# Altium schematic sheet p1_power_supply_10v.SchDoc
size A2; Organization: Protel International P/L; Address1: L3, 12a Rodborough Rd; Address2: Frenchs Forest; Address3: NSW; Address4: Australia 2086
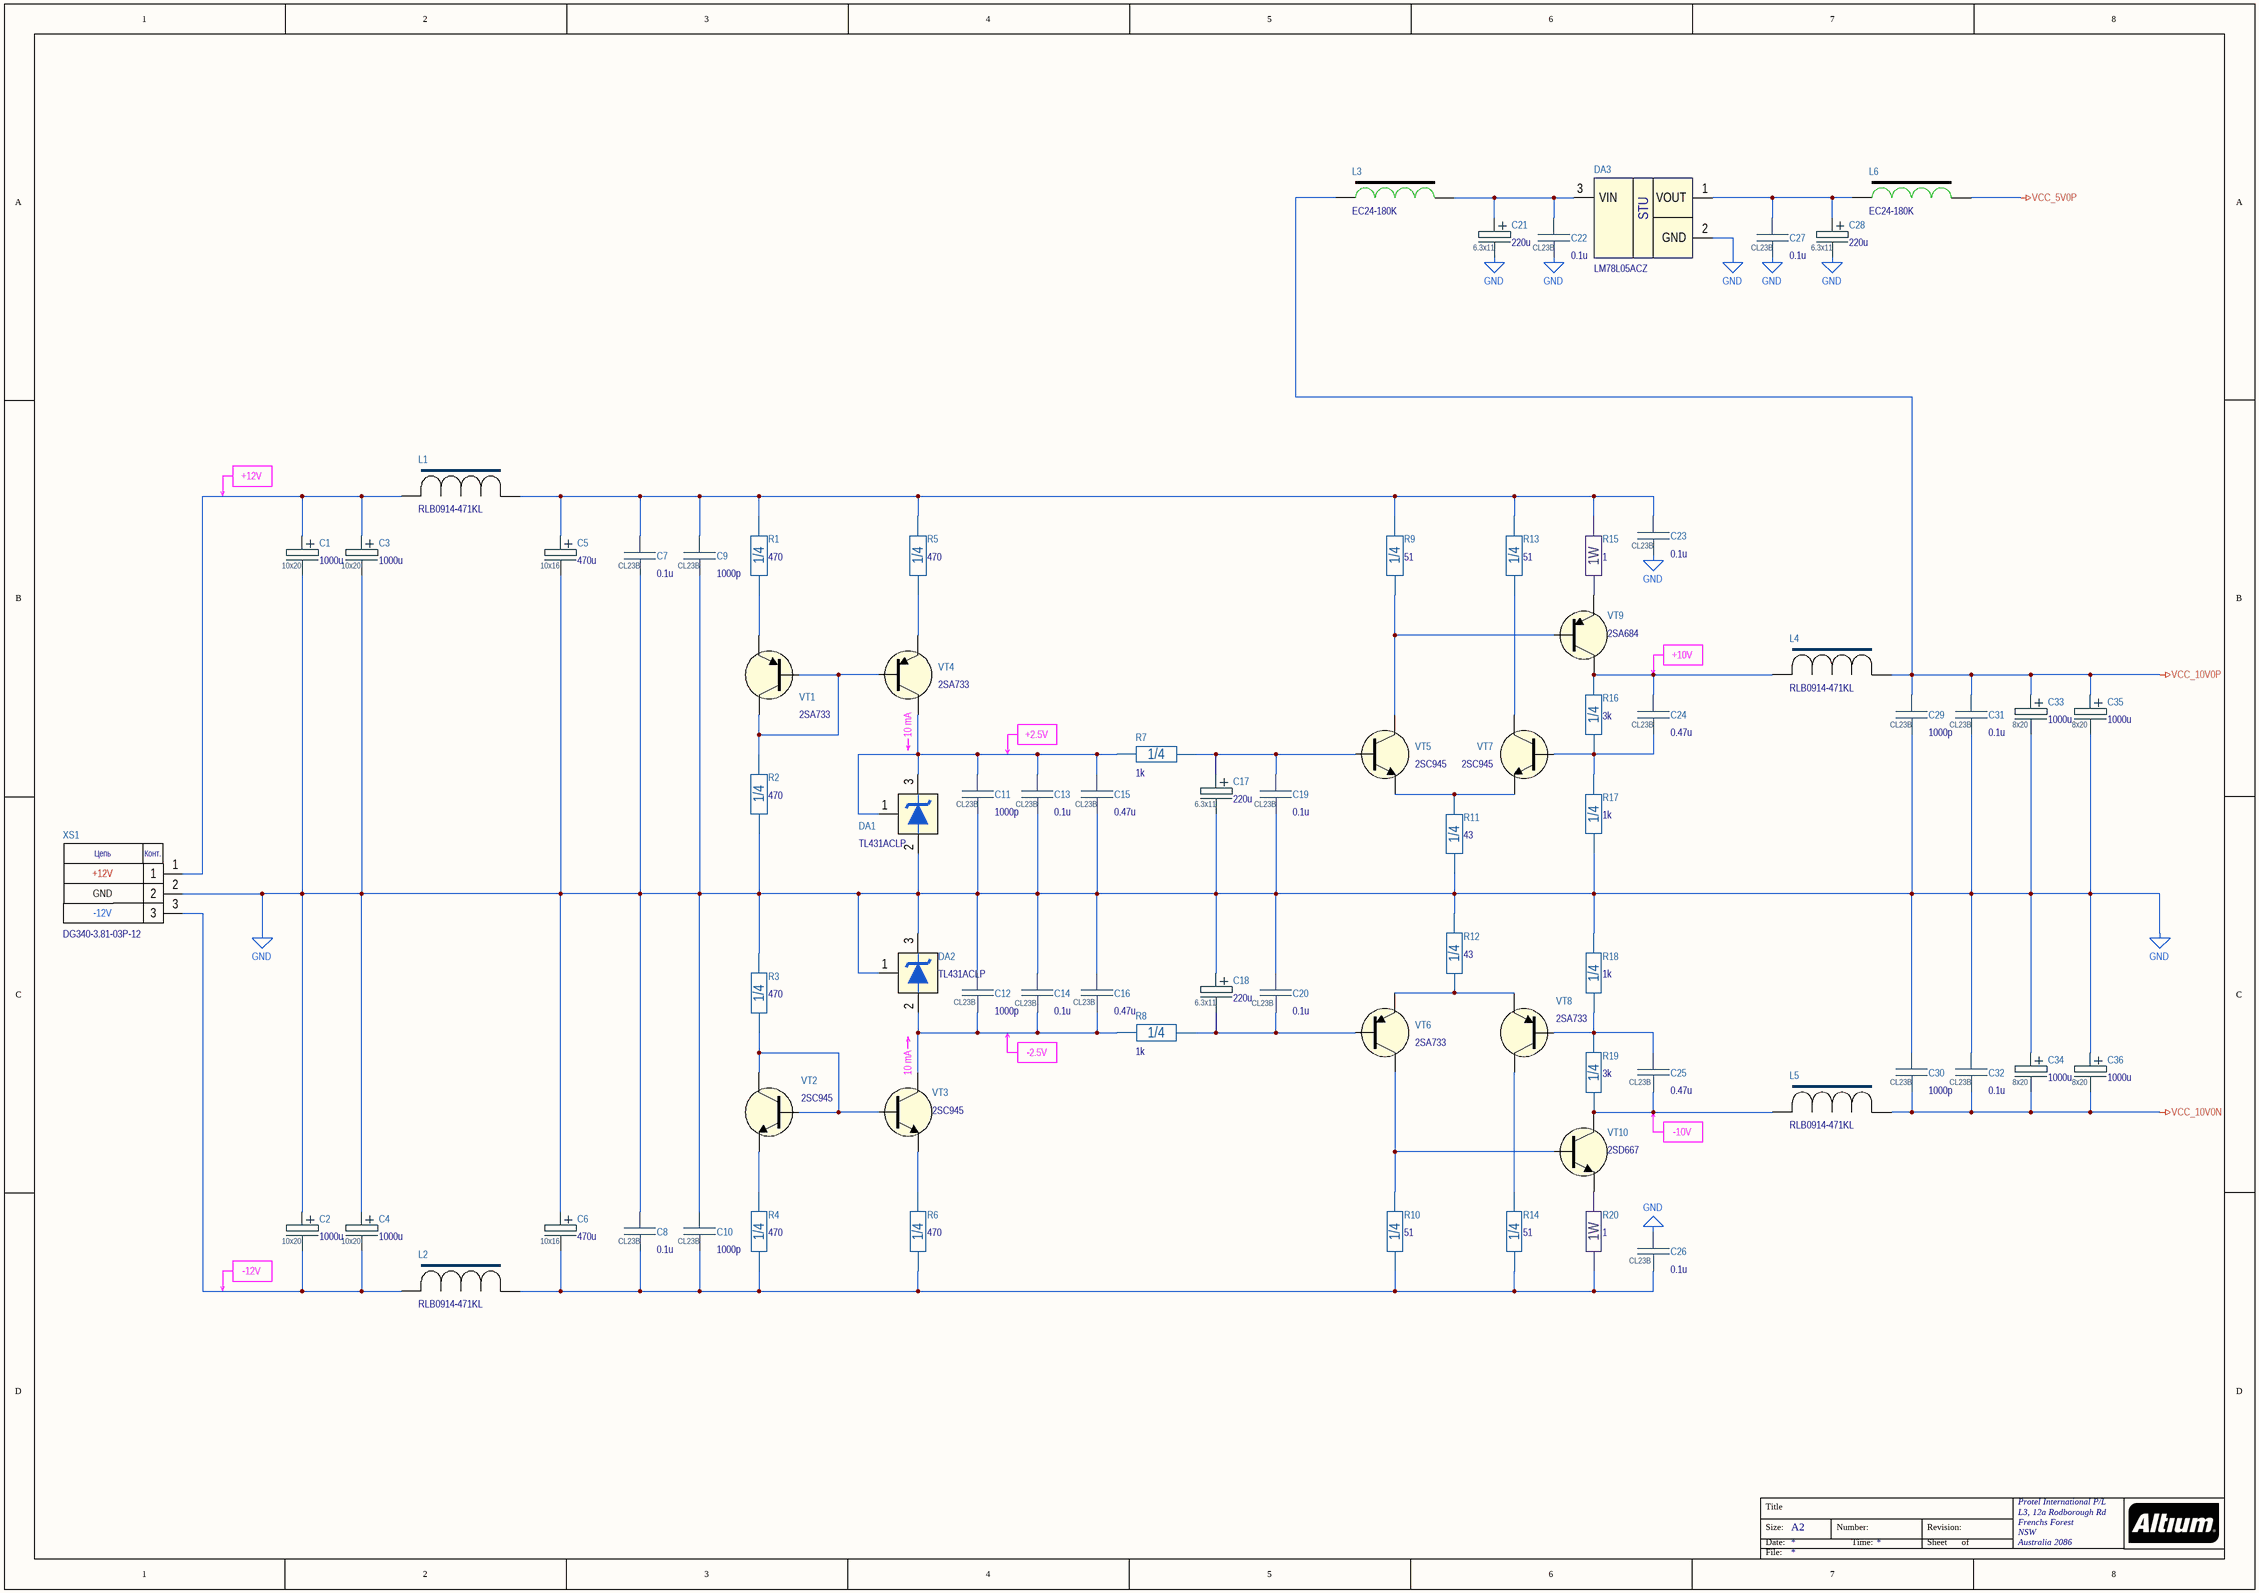
[diagram p0: p1_power_supply_10v.SchDoc]

## Parts
C1  1000u  Package: 10x20  [ECAP10X21X5_BRW]
C2  1000u  Package: 10x20  [ECAP10X21X5_BRW]
C3  1000u  Package: 10x20  [ECAP10X21X5_BRW]
C4  1000u  Package: 10x20  [ECAP10X21X5_BRW]
C5  470u  Package: 10x16  [ECAP10X17X5_BRW]
C6  470u  Package: 10x16  [ECAP10X17X5_BRW]
C7  0.1u  [CL23B_7.2x2.5]
C8  0.1u  [CL23B_7.2x2.5]
C9  1000p  [CL23B_7.2x2.5]
C10  1000p  [CL23B_7.2x2.5]
C11  1000p  [CL23B_7.2x2.5]
C12  1000p  [CL23B_7.2x2.5]
C13  0.1u  [CL23B_7.2x2.5]
C14  0.1u  [CL23B_7.2x2.5]
C15  0.47u  [CL23B_7.2x3.5]
C16  0.47u  [CL23B_7.2x3.5]
C17  220u  Package: 6.3x11  [ECAP6.3X11X2.5_BRW]
C18  220u  Package: 6.3x11  [ECAP6.3X11X2.5_BRW]
C19  0.1u  [CL23B_7.2x2.5]
C20  0.1u  [CL23B_7.2x2.5]
C21  220u  Package: 6.3x11  [ECAP6.3X11X2.5_BRW]
C22  0.1u  [CL23B_7.2x2.5]
C23  0.1u  [CL23B_7.2x2.5]
C24  0.47u  [CL23B_7.2x3.5]
C25  0.47u  [CL23B_7.2x3.5]
C26  0.1u  [CL23B_7.2x2.5]
C27  0.1u  [CL23B_7.2x2.5]
C28  220u  Package: 6.3x11  [ECAP6.3X11X2.5_BRW]
C29  1000p  [CL23B_7.2x2.5]
C30  1000p  [CL23B_7.2x2.5]
C31  0.1u  [CL23B_7.2x2.5]
C32  0.1u  [CL23B_7.2x2.5]
C33  1000u  Package: 8x20  [ECAP8X20X3.5_BRW]
C34  1000u  Package: 8x20  [ECAP8X20X3.5_BRW]
C35  1000u  Package: 8x20  [ECAP8X20X3.5_BRW]
C36  1000u  Package: 8x20  [ECAP8X20X3.5_BRW]
DA1  TL431ACLP  [TO-92 (VERTICAL,LINE)]
DA2  TL431ACLP  [TO-92 (VERTICAL,LINE)]
DA3  LM78L05ACZ  [TO-92 (VERTICAL,LINE)]
L1  RLB0914-471KL  [RLB0914]
L2  RLB0914-471KL  [RLB0914]
L3  EC24-180K  [EC24_GREEN]
L4  RLB0914-471KL  [RLB0914]
L5  RLB0914-471KL  [RLB0914]
L6  EC24-180K  [EC24_GREEN]
R1  470  Package: 1/4  [CFR-25]
R2  470  Package: 1/4  [CFR-25]
R3  470  Package: 1/4  [CFR-25]
R4  470  Package: 1/4  [CFR-25]
R5  470  Package: 1/4  [CFR-25]
R6  470  Package: 1/4  [CFR-25]
R7  1k  Package: 1/4  [CFR-25]
R8  1k  Package: 1/4  [CFR-25]
R9  51  Package: 1/4  [CFR-25]
R10  51  Package: 1/4  [CFR-25]
R11  43  Package: 1/4  [CFR-25]
R12  43  Package: 1/4  [CFR-25]
R13  51  Package: 1/4  [CFR-25]
R14  51  Package: 1/4  [CFR-25]
R15  1  Package: 1W  [CFR-100]
R16  3k  Package: 1/4  [CFR-25]
R17  1k  Package: 1/4  [CFR-25]
R18  1k  Package: 1/4  [CFR-25]
R19  3k  Package: 1/4  [CFR-25]
R20  1  Package: 1W  [CFR-100]
VT1  2SA733  [TO-92 (VERTICAL,LINE)]
VT2  2SC945  [TO-92 (VERTICAL,LINE)]
VT3  2SC945  [TO-92 (VERTICAL,LINE)]
VT4  2SA733  [TO-92 (VERTICAL,LINE)]
VT5  2SC945  [TO-92 (VERTICAL,LINE)]
VT6  2SA733  [TO-92 (VERTICAL,LINE)]
VT7  2SC945  [TO-92 (VERTICAL,LINE)]
VT8  2SA733  [TO-92 (VERTICAL,LINE)]
VT9  2SA684  [TO-92L (VERTICAL,LINE)]
VT10  2SD667  [TO-92L (VERTICAL,LINE)]
XS1  DG340-3.81-03P-12  [DG340-3.81-03P]

## Nets
GND: C1.2 C2.1 C3.2 C4.1 C5.2 C6.1 C7.2 C8.1 C9.2 C10.1 C11.2 C12.2 C13.2 C14.2 C15.2 C16.2 C17.2 C18.1 C19.2 C20.2 C21.2 C22.2 C23.2 C26.2 C27.2 C28.2 C29.2 C30.1 C31.2 C32.1 C33.2 C34.1 C35.2 C36.1 DA1.2(ANODE) DA2.1(REF) DA2.3(CATHODE) DA3.2(GND) R2.1 R3.1 R11.2 R12.2 R17.2 R18.2 XS1.2
VCC_5V0P: L6.2
VCC_10V0N: C30.2 C32.2 C34.2 C36.2 L5.2
VCC_10V0P: C29.1 C31.1 C33.1 C35.1 L3.1 L4.2
NetC1_1: C1.1 C3.1 L1.1 XS1.1
NetC2_2: C2.2 C4.2 L2.1 XS1.3
NetC5_1: C5.1 C7.1 C9.1 C23.1 L1.2 R1.2 R5.2 R9.2 R13.2 R15.2
NetC6_2: C6.2 C8.2 C10.2 C26.1 L2.2 R4.2 R6.2 R10.2 R14.2 R20.2
NetC11_1: C11.1 C13.1 C15.1 DA1.1(REF) DA1.3(CATHODE) R7.2 VT4.2(C)
NetC12_1: C12.1 C14.1 C16.1 DA2.2(ANODE) R8.2 VT3.2(C)
NetC17_1: C17.1 C19.1 R7.1 VT5.1(B)
NetC18_2: C18.2 C20.1 R8.1 VT6.1(B)
NetC21_1: C21.1 C22.1 DA3.3(VIN) L3.2
NetC24_1: C24.1 L4.1 R16.1 VT9.2(C)
NetC24_2: C24.2 R16.2 R17.1 VT7.1(B)
NetC25_1: C25.1 L5.1 R19.1 VT10.2(C)
NetC25_2: C25.2 R18.1 R19.2 VT8.1(B)
NetC27_1: C27.1 C28.1 DA3.1(VOUT) L6.1
NetR1_1: R1.1 VT1.3(E)
NetR2_2: R2.2 VT1.1(B) VT1.2(C) VT4.1(B)
NetR3_2: R3.2 VT2.1(B) VT2.2(C) VT3.1(B)
NetR4_1: R4.1 VT2.3(E)
NetR5_1: R5.1 VT4.3(E)
NetR6_1: R6.1 VT3.3(E)
NetR9_1: R9.1 VT5.2(C) VT9.3(B)
NetR10_1: R10.1 VT6.2(C) VT10.3(B)
NetR11_1: R11.1 VT5.3(E) VT7.3(E)
NetR12_1: R12.1 VT6.3(E) VT8.3(E)
NetR13_1: R13.1 VT7.2(C)
NetR14_1: R14.1 VT8.2(C)
NetR15_1: R15.1 VT9.1(E)
NetR20_1: R20.1 VT10.1(E)

## Notes on the sheet
- +12V
- +10V
- (near VT4) 10 mA
- +2.5V
- GND
- -12V
- -2.5V
- (near VT3) 10 mA
- -10V
- Title
- Size:
- Date:
- File:
- A2
- Number:
- Time:
- Revision:
- Sheet
- of
- (in symbol DG340-3.81-03P-12) Цепь; Конт.
- (in symbol LM78L05ACZ) STU

## Library data of the parts
C1-C4 = C_ECAP: Aluminium capacitor; Part Number: UVZ1E102MPD; Manufacturer: Nichicon; Tolerance: ± 20 %; Voltage: 25V; Value: 1000u; Value on schem: 1000u
C5 C6 = C_ECAP: Aluminium capacitor; Part Number: UPW1E471MPD; Manufacturer: Nichicon; Tolerance: ± 20 %; Voltage: 25V; Value: 470u; Value on schem: 470u
C7-C16 C19 C20 C22-C27 C29-C32 = CL23B: Box-type metallized polyester film capacitor; Tolerance: ± * %; Voltage: 63V; Dielectric: Polyester; Part Number: *; Manufacturer: *; Package: CL23B
  C7 C8 C13 C14 C19 C20 C22 C23 C26 C27 C31 C32: Value: 0.1u; Value on schem: 0.1u
  C9-C12 C29 C30: Value: 1000p; Value on schem: 1000p
  C15 C16 C24 C25: Value: 0.47u; Value on schem: 0.47u
C17 C18 C21 C28 = C_ECAP: Aluminium capacitor; Part Number: EKZH160ELL221MF11D; Manufacturer: Nichicon; Tolerance: ± 20 %; Voltage: 16V; Value: 220u; Value on schem: 220u
C33-C36 = C_ECAP: Aluminium capacitor; Part Number: UHV1C102MPD6; Manufacturer: Nichicon; Tolerance: ± 20 %; Voltage: 16V; Value: 1000u; Value on schem: 1000u
DA1 DA2 = TL431ACLP: Precision Programmable Reference; Manufacturer: Texas Instruments; Part Number: TL431ACLP; Package: TO-92
DA3 = LM78L05ACZ: 100-mA Fixed Output Linear Regulator; Manufacturer: Texas Instruments; Part Number: LM78L05ACZ; Package: TO-92
L1 L2 L4 L5 = RLB0914: Radial Inductors; Manufacturer: Bourns Inc.; RDC: 1.3 Ohm; SRF Min: 1.8 MHz; Q: 20; Irms  Max: 0.56 A; Isat  Typ: 1.0 A; Inductance @ 100 kHz: 470 µH; Part Number: RLB0914-471KL; Package: 8.7x12mm
L3 L6 = EC24: Axial leaded coated inductors; Manufacturer: 3L Electronic; RDC: 1 Ohm; SRF Min: 15 MHz; Q: 40; Irms  Max: 315 mA; Inductance @ 100 kHz: 18 µH; Part Number: EC24-180K; Package: EC24
R1-R6 = CF25: Resistor 1/4W; Part Number: MFP-25BRD52-470R; Manufacturer: Yageo; Tolerance: ± 0.1 %; Voltage: 250V; Temperature Coefficient: ±20 ppm/°C; Value: 470; Value on schem: 470
R7 R8 R17 R18 = CF25: Resistor 1/4W; Part Number: MFR-25FTF52-10K; Manufacturer: Yageo; Tolerance: ± 1 %; Voltage: 250V; Temperature Coefficient: ±100 ppm/°C; Value: 1k; Value on schem: 1k
R9 R10 R13 R14 = CF25: Resistor 1/4W; Part Number: MFP-25BRD52-51R; Manufacturer: Yageo; Tolerance: ± 0.1 %; Voltage: 250V; Temperature Coefficient: ±20 ppm/°C; Value: 51; Value on schem: 51
R11 R12 = CF25: Resistor 1/4W; Part Number: MFR-25FTF52-43R; Manufacturer: Yageo; Tolerance: ± 1 %; Voltage: 250V; Temperature Coefficient: ±100 ppm/°C; Value: 43; Value on schem: 43
R15 R20 = CF100: Resistor 1W; Part Number: KNP100FB-73-1R; Manufacturer: Yageo; Tolerance: ± 1 %; Voltage: 250V; Temperature Coefficient: ±200 ppm/°C; Value: 1; Value on schem: 1
R16 R19 = CF25: Resistor 1/4W; Part Number: MFR-25FTF52-3K; Manufacturer: Yageo; Tolerance: ± 1 %; Voltage: 250V; Temperature Coefficient: ±100 ppm/°C; Value: 3k; Value on schem: 3k
VT1 VT4 VT6 VT8 = 2SA733: General Purpose p-n-p Transistors; Manufacturer: NEC; Package: TO-92; Part Number: 2SA733
VT2 VT3 VT5 VT7 = 2SC945: General Purpose n-p-n Transistors; Manufacturer: NEC; Package: TO-92; Part Number: 2SC945
VT9 = 2SA684: General Purpose p-n-p Transistors -60V, -1A; Manufacturer: Secos; Package: TO-92L; Part Number: 2SA684
VT10 = 2SD667: General Purpose n-p-n Transistors 120V, 1A; Manufacturer: Secos; Package: TO-92L; Part Number: 2SD667
XS1 = DG340-3.81-03P-12: 3-way screw terminal, pitch 150mils (3.81mm); Manufacturer: DEGSON; Part Number: DG340-3.81-03P-12